# Altium project RFTP2917.PrjPcb
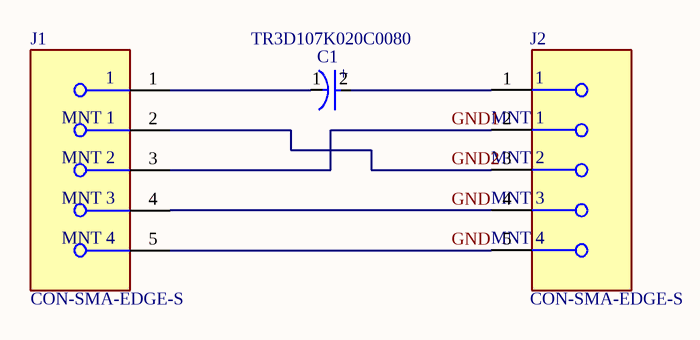
[diagram p0: RFTP2917.SchDoc]
1 sheet, 3 parts. Net scope: global (net labels, ports and power ports of the same name join across sheets).
Board file: RFTP2917.PcbDoc

## Sheet RFTP2917.SchDoc
size A; SheetNumber: 1; SheetTotal: 1

### Parts
C1  TR3D107K020C0080  [FP-TR3D-MFG]
J1  CON-SMA-EDGE-S  [FP-CON-SMA-EDGE-S-MFG]
J2  CON-SMA-EDGE-S  [FP-CON-SMA-EDGE-S-MFG]

### Nets
GND: J1.4(MNT_3) J1.5(MNT_4) J2.4(MNT_3) J2.5(MNT_4)
GND1: J1.3(MNT_2) J2.2(MNT_1)
GND2: J1.2(MNT_1) J2.3(MNT_2)
NetC1_1: C1.1(C) J1.1
NetC1_2: C1.2(A) J2.1

### Notes on the sheet
- (in symbol CMP-00030-44433242-1) +

### Library data of the parts
C1 = CMP-00030-44433242-1: TR3D107K020C0080 Surface Mount Tantalum Capacitor, 100 uF, 20 V, ± 10%, -55 °C, 125 °C, 2917 [7343-31 Metric]; Capacitance: 100µF; ESR (Equivalent Series Resistance): 80mΩ; Ripple Current: 1.37A; Voltage Rating: 20V; Leakage Current: 20µA; Dissipation Factor: 8%; Polarity: Polar; Height - Seated (Max): 3.0988mm; RoHS: Compliant; Case Code (Imperial): 2917; Radiation Hardening: No; Mount: Surface Mount; Width: 4.3mm; Height: 3.1mm; Termination: SMD/SMT; Case Code (Metric): 7343; REACH SVHC: Unknown; NexarPartId: 44433242; Length: 7.3mm; Features: General Purpose; Tolerance: 10%; Voltage Rating (DC): 20V; Depth: 4.3mm; Max Operating Temperature: 125°C; Lead Free: Lead Free; Case/Package: 2917; Schedule B: 8532210050, 8532210050; Packaging: Tape and Reel; Min Operating Temperature: -55°C
J1 J2 = CMP-204357-000001-1: CONN SMA JACK STR EDGE MNT; Manufacturer: RF Solutions Ltd.; Impedance: 50Ω; Conn Orientation: Right Angle; Is Female: yes; Number Of Contacts: 1; Frequency: 18GHz; Shielding: true; Category: Conn; ComponentLink2URL: https://www.rfsolutions.co.uk/downloads/1498648656DS-CON-EDGE-SMA-4.pdf; Octopart: https://octopart.com/con-sma-edge-s-rf+solutions-70967450; Package: CONN_JACK; Manufacturer Part Number: CON-SMA-EDGE-S; Height: 6.35mm; Device Class L1: Connectors; Footprint Url: https://forum.upverter.com/uploads/default/original/3X/b/e/be75b907af57498775929d6d9099689c472e0307.pdf; Contact Material: Gold; ComponentLink2Description: Datasheet; Device Class L2: RF / Coaxial Connectors; RoHS: TRUE; Device Class L3: unset; Digikey Description: CONN SMA JACK STR EDGE MNT; Lead Free: Yes; Automotive: No